# Altium schematic sheet schematic.SchDoc
size A4; SheetNumber: 1; SheetTotal: 1
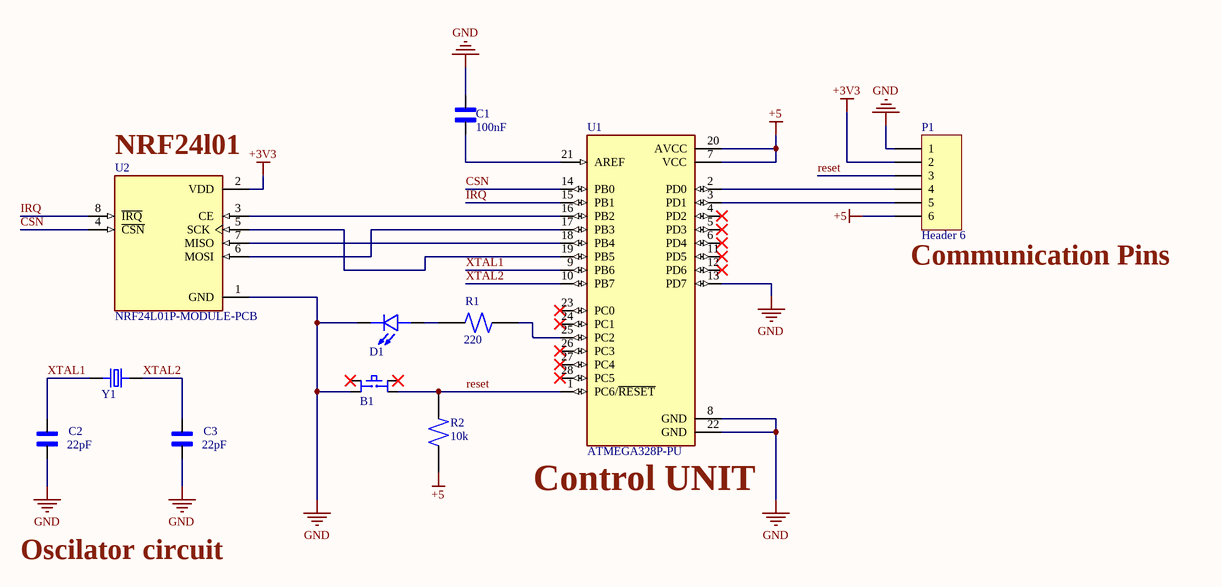
[diagram p0: schematic.SchDoc]

## Parts
B1  Push button  [SW_TS02-66-95-BK-260-LCR-D]  (value not drawn)
C1  100nF  [CAPRB500W50L450T300H550]
C2  22pF  [CAPRB500W50L450T300H550]
C3  22pF  [CAPRB500W50L450T300H550]
D1  L08R5000Q1  [LEDRD254W57D500H1070]  (value not drawn)
P1  Header 6  [HDR1X6]
R1  220  [RESAD1100W55L680D260]
R2  10k  [RESAD1100W55L680D260]
U1  ATMEGA328P-PU  [DIP794W46P254L2967H457Q28B]
U2  NRF24L01P-MODULE-PCB  [XCVR_NRF24L01P-MODULE-PCB]
Y1  ECS-160-S-4  [XTAL_ECS-160-20-4X]  (value not drawn)

## Nets
+3V3: P1.2 U2.2(VDD)
+5: P1.6 R2.1 U1.7(VCC) U1.20(AVCC)
GND: B1.2 C1.1 C2.1 C3.1 D1.C P1.1 U1.8(GND) U1.13(PD7) U1.22(GND) U2.1(GND)
CSN: U1.14(PB0) U2.4(~{CSN})
IRQ: U1.15(PB1) U2.8(~{IRQ})
reset: B1.4 P1.3 R2.2 U1.1(PC6/~{RESET})
XTAL1: C2.2 U1.9(PB6) Y1.1
XTAL2: C3.2 U1.10(PB7) Y1.2
NetC1_2: C1.2 U1.21(AREF)
NetD1_A: D1.A R1.2
NetP1_4: P1.4 U1.2(PD0)
NetP1_5: P1.5 U1.3(PD1)
NetR1_1: R1.1 U1.25(PC2)
NetU1_16: U1.16(PB2) U2.3(CE)
NetU1_17: U1.17(PB3) U2.6(MOSI)
NetU1_18: U1.18(PB4) U2.7(MISO)
NetU1_19: U1.19(PB5) U2.5(SCK)

Not connected (* = marked no-connect by the designer): B1 1* 3*; U1 4(PD2)* 5(PD3)* 6(PD4)* 11(PD5)* 12(PD6)* 23(PC0)* 24(PC1)* 26(PC3)* 27(PC4)* 28(PC5)*

## Notes on the sheet
- (near U2) NRF24l01
- (near P1) Communication Pins
- (near U1) Control UNIT
- Oscilator circuit

## Library data of the parts
C1-C3 = Ceramic capacitor: 2200 pF Â±10% 250V Ceramic Capacitor X7R Radial; MF: TDK; MP: FG24X7R2E222KNT06; Digi-Key_Part_Number: 445-173386-1-ND; Purchase-URL: https://pricing.snapeda.com/search/part/FG24X7R2E222KNT06/?ref=eda; Check_prices: https://www.snapeda.com/parts/FG24X7R2E222KNT06/TDK/view-part/?ref=eda; Value: *; Package: Radial TDK; SnapEDA_Link: https://www.snapeda.com/parts/FG24X7R2E222KNT06/TDK/view-part/?ref=snap
D1 = LED: LED, Orange, Through Hole, T-1 3/4 (5mm), 30 mA, 2.1 V, 635 nm; MF: {'manufacturer': u'LED Technology'}; Price: None; Package: None; Availability: Unavailable; MP: L08R5000Q1; Value: *
P1 = Header 6: Header, 6-Pin; LatestRevisionDate: 17-Jul-2002; LatestRevisionNote: Re-released for DXP Platform.; Publisher: Altium Limited
R1 R2 = Resistor (0.25W): (MFR-25FBF52-10K) 10,2 kOhm bei 1% 0,25W, 1/4W Durchbohrlochwiderstand Axial Metal Film; MF: Yageo; Digi-Key_Part_Number: 10.2KXBK-ND; SnapEDA_Link: https://www.snapeda.com/parts/MFR-25FBF52-10K/Yageo/view-part/424333/?ref=snap; Package: Axial Yageo; Purchase-URL: https://pricing.snapeda.com/search/part/MFR-25FBF52-10K/?ref=eda; MP: MFR-25FBF52-10K; Value: *
U1 = ATMEGA328P-PU: ATmega Series 20 MHz 32 KB Flash 2 KB SRAM 8-Bit Microcontroller - DIP-28; Value: *; MP: ATMEGA328P-PU; Package: None; Availability: Unavailable; Price: None
U2 = NRF24L01P-MODULE-PCB: - Transceiver For Use With nRF24L01+; MF: Nordic Semiconductor; Package: None; MP: NRF24L01P-MODULE-PCB; Value: *; Availability: Bad; Price: None; SnapEDA_Link: https://www.snapeda.com/parts/NRF24L01P-MODULE-PCB/Nordic%20Semiconductor%20ASA/view-part/230534/?ref=snap; Mouser-Purchase-URL: https://snapeda.com/shop?store=Mouser&id=230534
Y1 = Crystal oscilator: CRYSTAL T/H; MF: {'manufacturer': u'ECS Inc.'}; Package: None; Value: *; MP: ECS-160-S-4; Availability: Unavailable; Price: None